# EAGLE design EV6 (EAGLE 9.6.1)
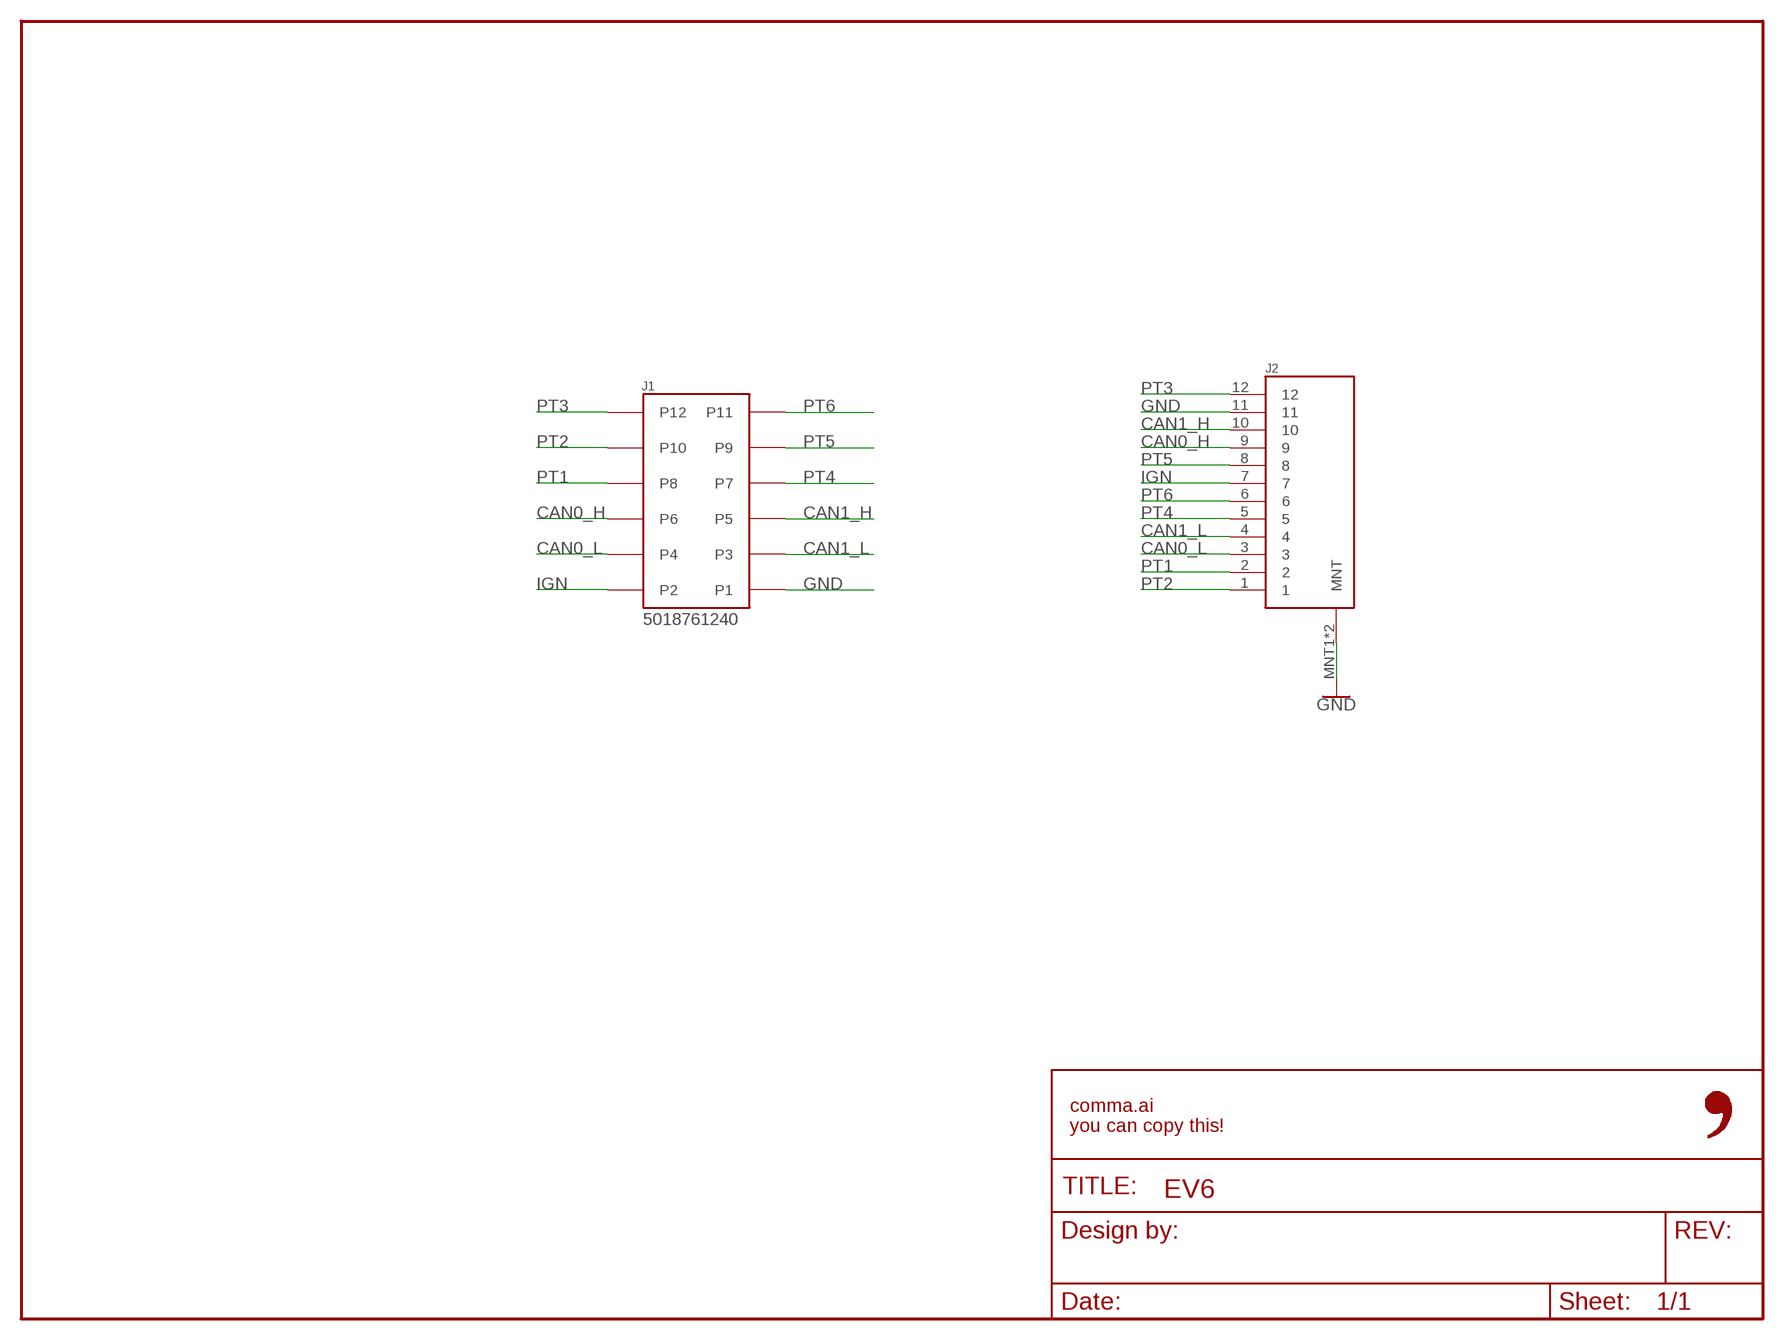
[diagram p0: schematic, sheet 1]

## Parts
FRAME1  FRAME-LETTER-OPENNO_PACKAGE  [DUMMY]
J1  5018761240  [5018761240]
J2  MG646151  [MG646151]

## Nets
CAN0_H: J1.P6 J2.9
CAN0_L: J1.P4 J2.3
CAN1_H: J1.P5 J2.10
CAN1_L: J1.P3 J2.4
GND: J1.P1 J2.11 J2.MNT1(MNT) J2.MNT2(MNT)
IGN: J1.P2 J2.7
PT1: J1.P8 J2.2
PT2: J1.P10 J2.1
PT3: J1.P12 J2.12
PT4: J1.P7 J2.5
PT5: J1.P9 J2.8
PT6: J1.P11 J2.6

## Notes on the sheet
- 5018761240

## Library data of the parts
FRAME1 = comma.ai:FRAME-LETTER-OPEN: Schematic Frame - Letter Standard 8.5x11 US Letter frame; DESIGNER: Nobody; VERSION: v01
J1 = 5018761440:5018761240; CPN: CAI-HARNESS-MOLEX-5018761240; MPN: 5018761240
J2 = comma.ai:MG646151; CPN: CAI-HARNESS-KET-MG646151-5; MPN: MG646151-5

## Board
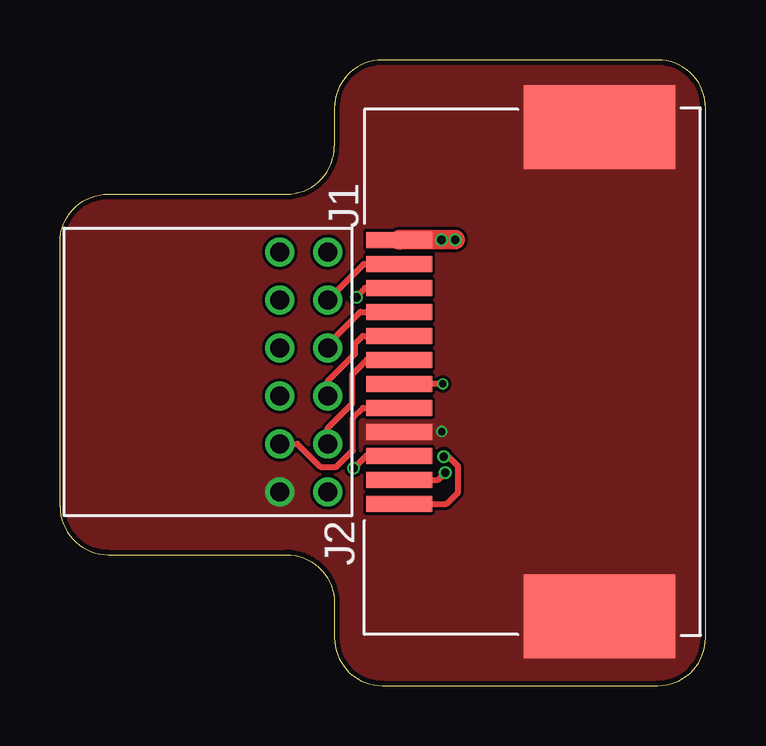
[diagram p1: board, top side]
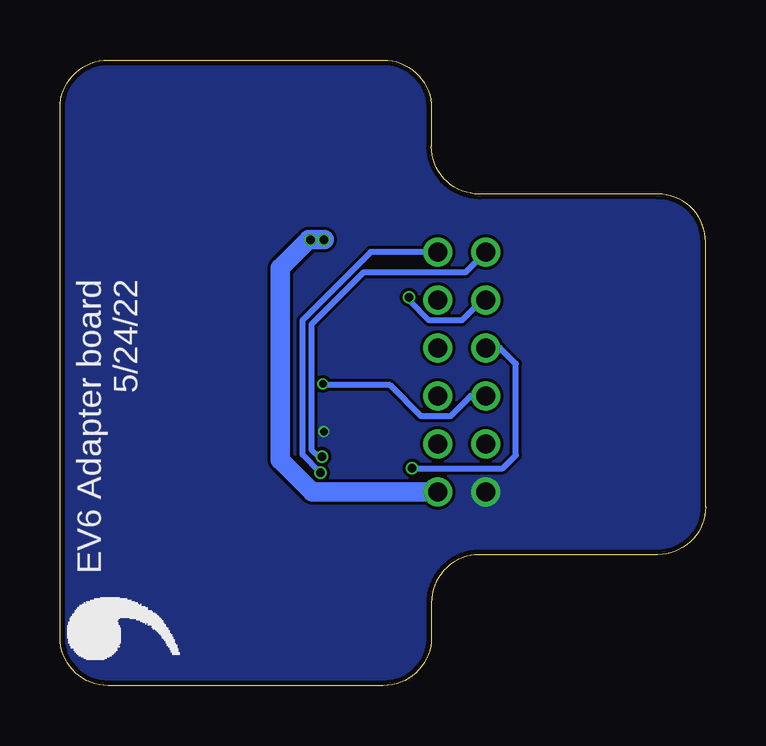
[diagram p2: board, bottom side, seen from below]

Size 26.9 x 26.09 mm. Coordinates in mm from the lower left corner, seen from the top.
Outline: 24.9,0 arc90 26.9,2 26.9,24.09 arc90 24.9,26.09 13.43,26.09 arc90 11.43,24.09 11.43,22.49 arc-90 9.43,20.49 2,20.49 arc90 0,18.49 0,7.46 arc90 2,5.46 9.43,5.46 arc-90 11.43,3.46 11.43,2 arc90 13.43,0 24.9,0
Copper layers (1*16): Top 0.035mm / dielectric 1.5mm / Bottom 0.035mm
Design rules "jlcpcb_2layer": minimum track width 5mil, minimum drill 12mil, track to track 5mil, track to pad 5mil, pad to pad 5mil, via to via 5mil, smd to smd 5mil, copper to edge 8mil, drill to drill 8mil, minimum pad ring 3mil, minimum via ring 3mil, stop-mask expansion 4mm, vias tented up to drill 20mil, thermal gap 10mil

### Footprints (pad centres in the part's own frame; a part is rotated, then mirrored left to right if it is on the bottom)
5018761240 = drill 0.8: P1 5,-1; P2 5,1; P3 3,-1; P4 3,1; P5 1,-1; P6 1,1; P7 -1,-1; P8 -1,1; P9 -3,-1; P10 -3,1; P11 -5,-1; P12 -5,1
MG646151 = smd 0.66 x 2.75: 1 4.5,8.35; 2 2.5,8.35; 3 0.5,8.35; 4 -1.5,8.35; 5 -3.5,8.35; 6 -5.5,8.35; 7 5.5,8.35; 8 3.5,8.35; 9 1.5,8.35; 10 -0.5,8.35; 11 -2.5,8.35; 12 -4.5,8.35 | smd 3.5 x 6.3: MNT1 -10.2,0; MNT2 10.2,0

### Placement (x,y rotation side)
FRAME1  -13.97,27.05 0 top  (outside the outline)
J1  10.16,13.08 270 top
J2  22.48,13.08 90 top
U$1  [LOGO]  21.62,0.4 90 bottom

### Tracks (layer width: path | path; a pad name or v marks a point on that pad's centre or on a via)
CAN0_H
  Top 0.254: J1.P6 11.16,12.7 12.3,13.84 12.3,14.26 12.62,14.58 J2.9
CAN0_L
  Top 0.254: J1.P4 11.16,10.75 12.17,11.76 12.17,12.97 12.78,13.58 J2.3
CAN1_H  (via drill 0.3)
  Top 0.254: v15.95,12.58 J2.10
  Bottom 0.254: J1.P5 9.79,12.08 10.64,11.23 11.85,11.23 13.15,12.53 15.9,12.53 v15.95,12.58
CAN1_L
  Top 0.254: J1.P3 9.89,10.08 10.85,9.12 11.52,9.12 12.2,9.8 12.2,11.15 12.63,11.58 J2.4
GND  (via drill 0.3)
  other vias: 15.91,10.59
  pour Top (no thermals): 27.94,27.05 -3.81,27.05 -3.81,-2.09 27.94,-2.09
  pour Bottom (no thermals): -2.54,28.32 -2.54,-0.62 29.21,-0.62 29.21,28.32
IGN  (via drill 0.35)
  Top 0.813: J2.7 v16.47,18.59
  Bottom 0.813: J1.P2 16.39,8.08 17.72,9.41 17.72,17.4 16.53,18.59 v16.47,18.59 v15.9,18.59
PT1
  Top 0.254: J1.P8 11.16,14.22 12.52,15.58 J2.2
PT2
  Top 0.254: J1.P10 12.66,17.58 J2.1
PT3  (via drill 0.35)
  Top 0.254: J2.12 15.75,8.58 v16.05,8.88
  Bottom 0.254: J1.P12 13.96,18.08 16.81,15.23 16.81,9.64 v16.05,8.88
PT4  (via drill 0.35)
  Top 0.254: v12.23,9.06 12.75,9.58 J2.5
  Bottom 0.254: v12.23,9.06 8.45,9.06 7.91,9.6 7.91,13.41 8.58,14.08 J1.P7
PT5  (via drill 0.35)
  Top 0.254: v12.36,16.19 12.36,16.23 12.71,16.58 J2.8
  Bottom 0.254: J1.P9 9.31,16.08 10.16,15.23 11.51,15.23 12.36,16.07 v12.36,16.19
PT6  (via drill 0.35)
  Top 0.254: J2.6 16.11,7.58 16.59,8.06 16.59,9.13 16.17,9.55 v15.99,9.55
  Bottom 0.254: J1.P11 10.01,17.23 14.26,17.23 16.43,15.06 16.43,9.83 16.15,9.55 v15.99,9.55

### Text on the board
bNames: EV6 Adapter board / 5/24/22